# Altium schematic sheet DDR3 - REGULATORS.SchDoc
size A3; DocumentNumber: 10; SheetNumber: 10; SheetTotal: 17
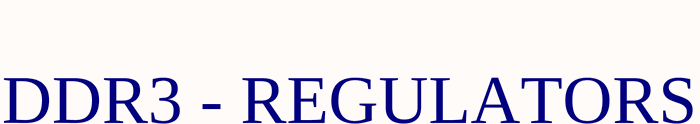
[diagram p0: DDR3 - REGULATORS.SchDoc]

## Notes on the sheet
- DDR3 - REGULATORS